# EAGLE schematic unicycle (EAGLE 4.11)
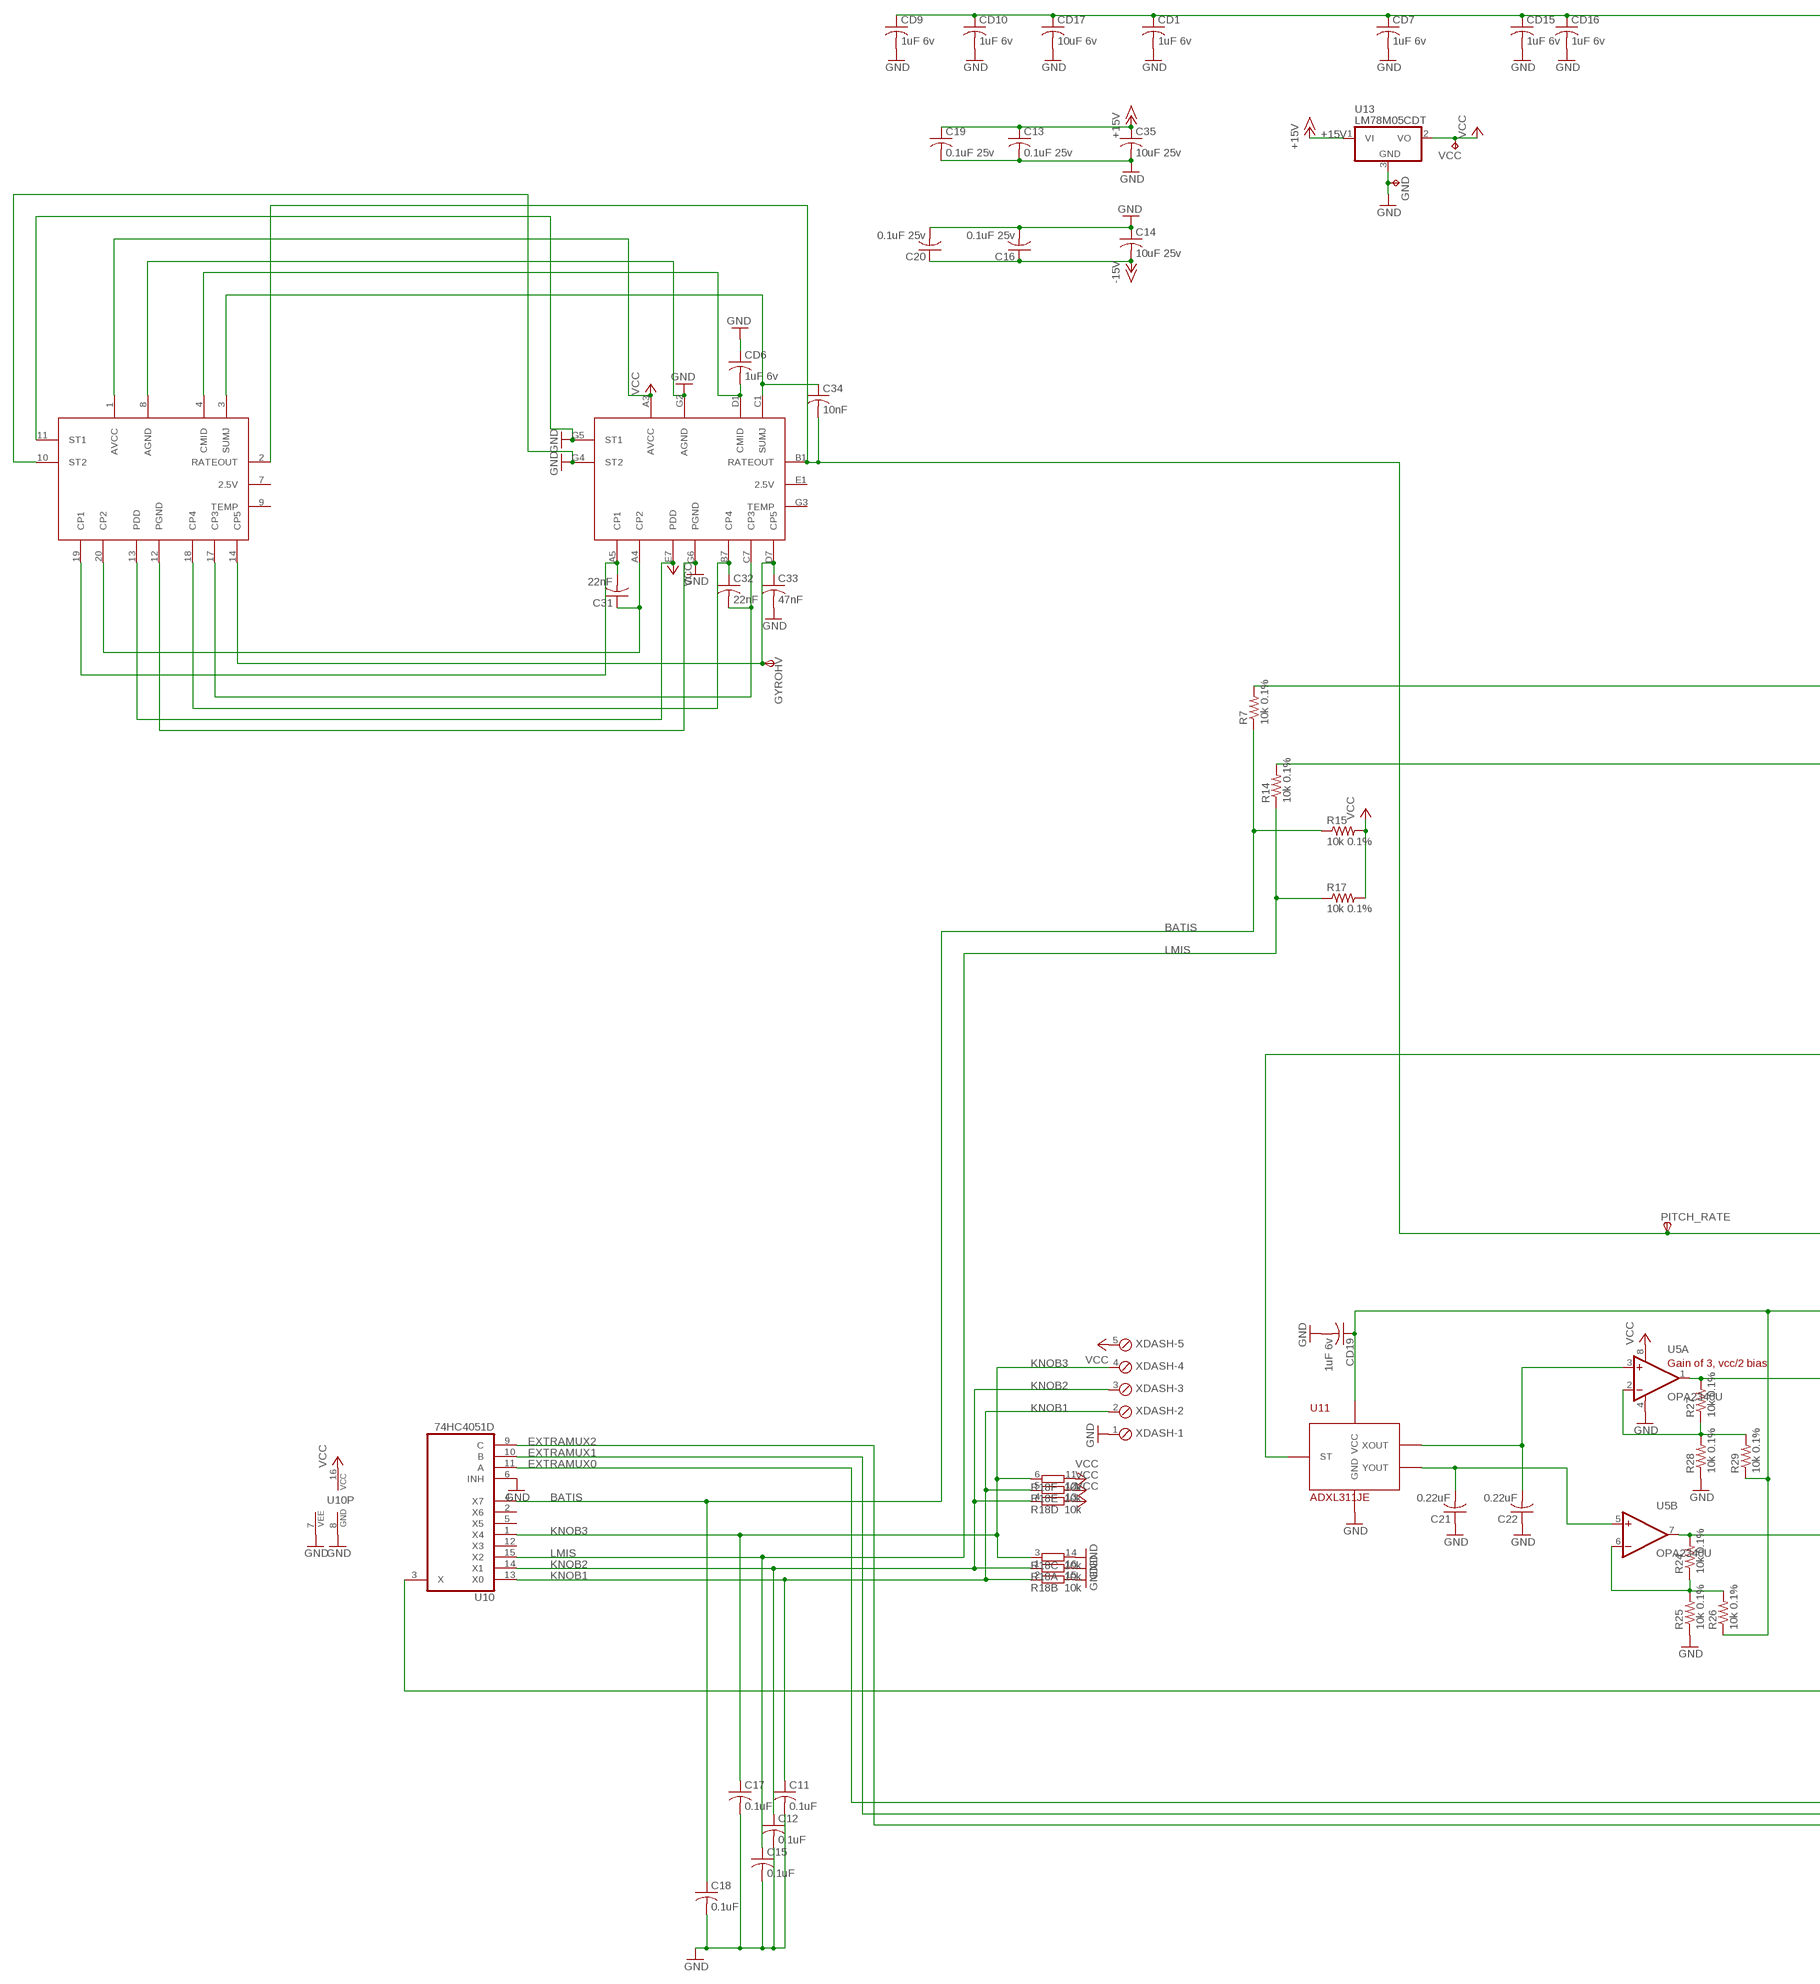
[diagram p0: schematic, sheet 1, part 1 of 3]
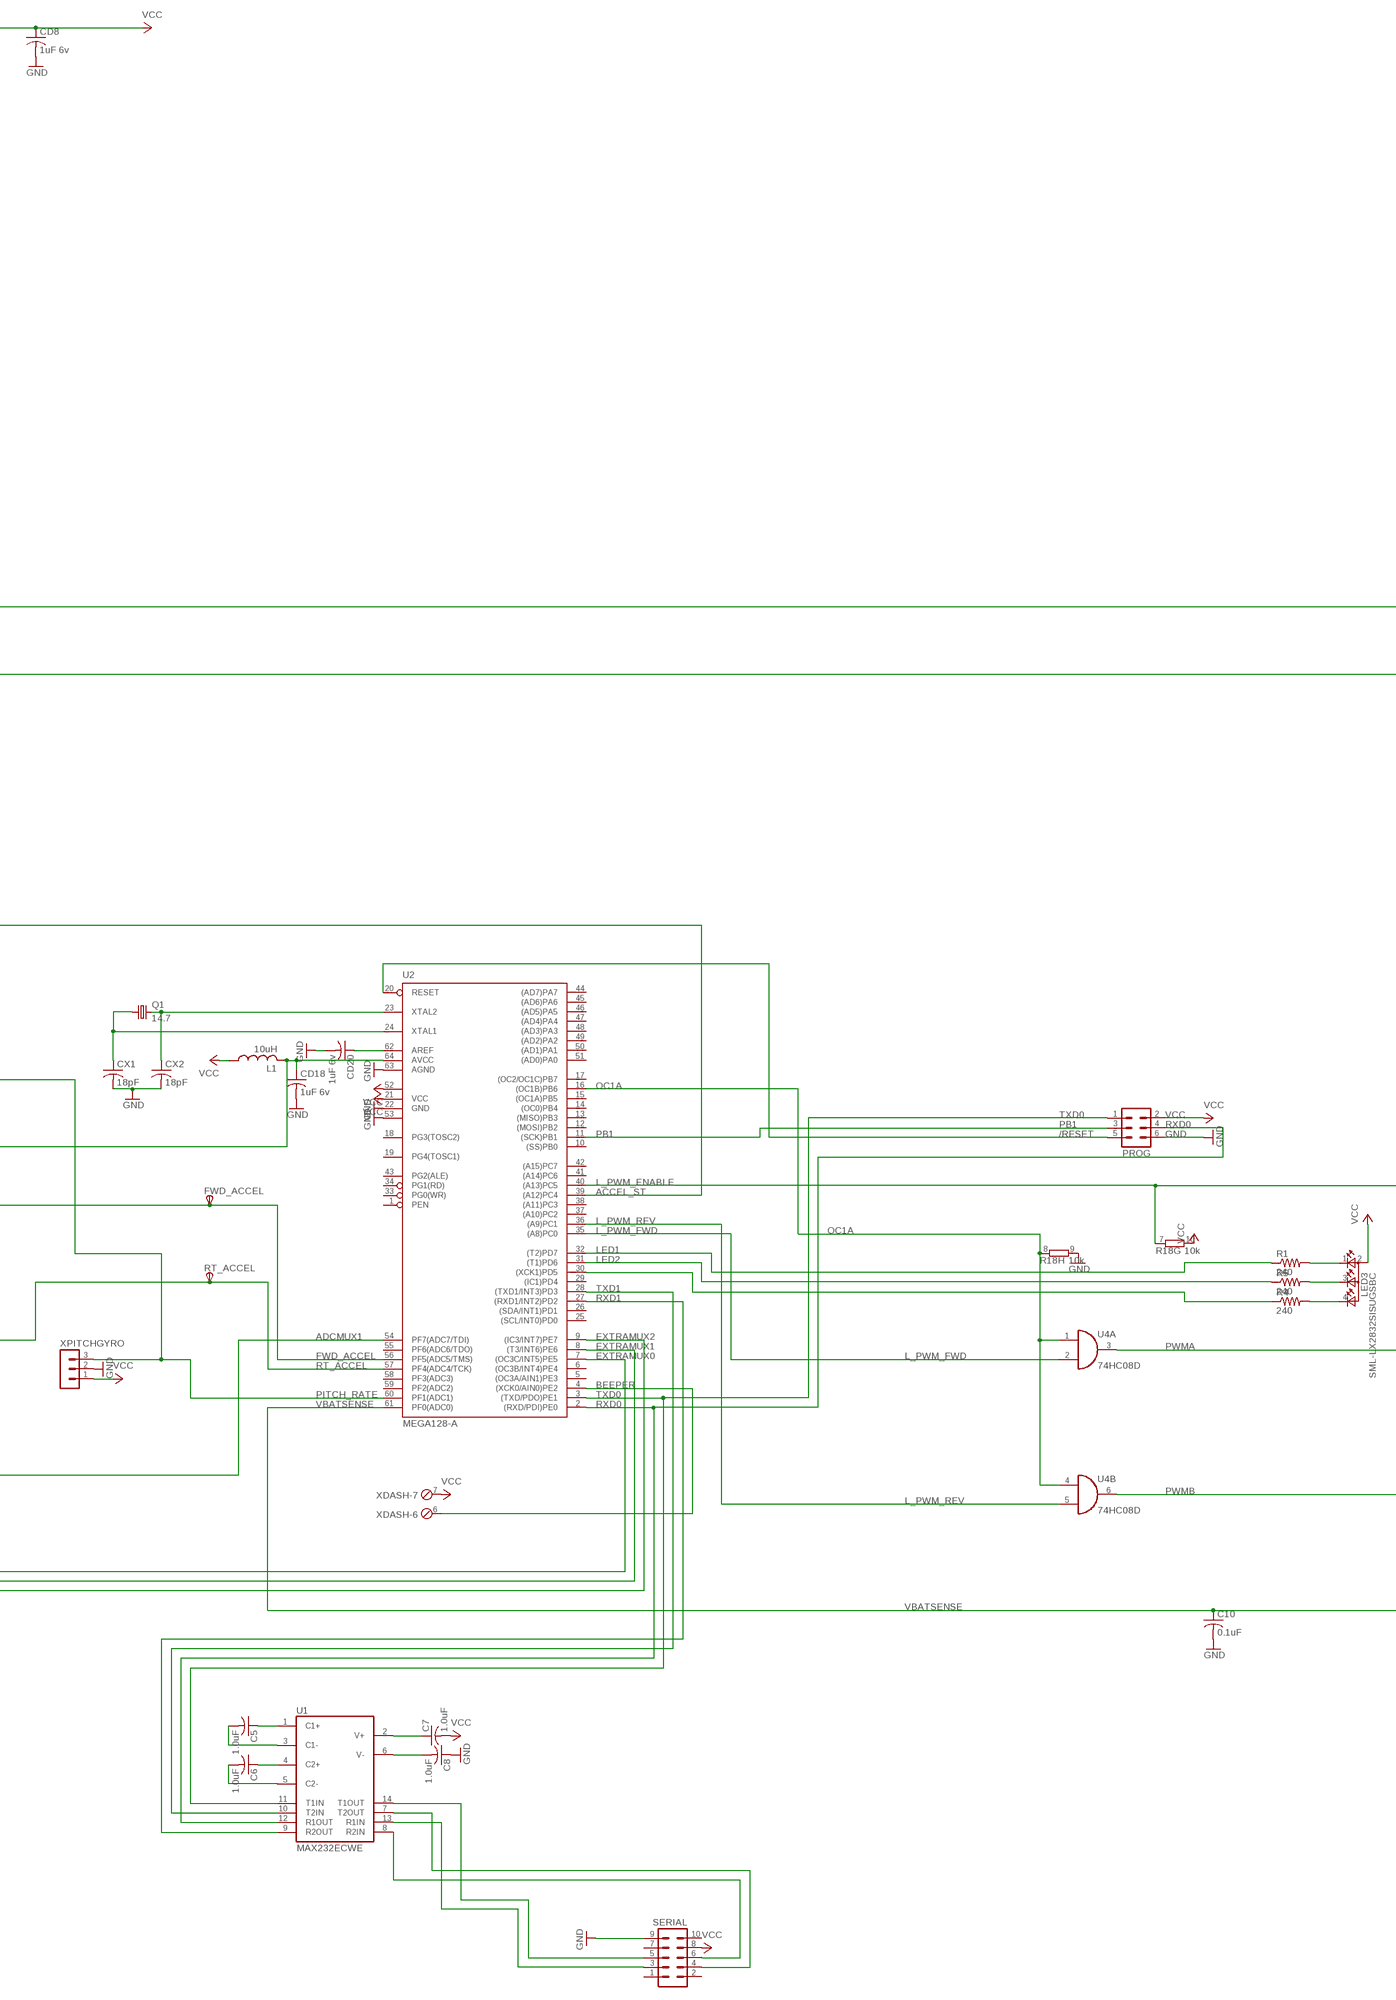
[diagram p1: schematic, sheet 1, part 2 of 3]
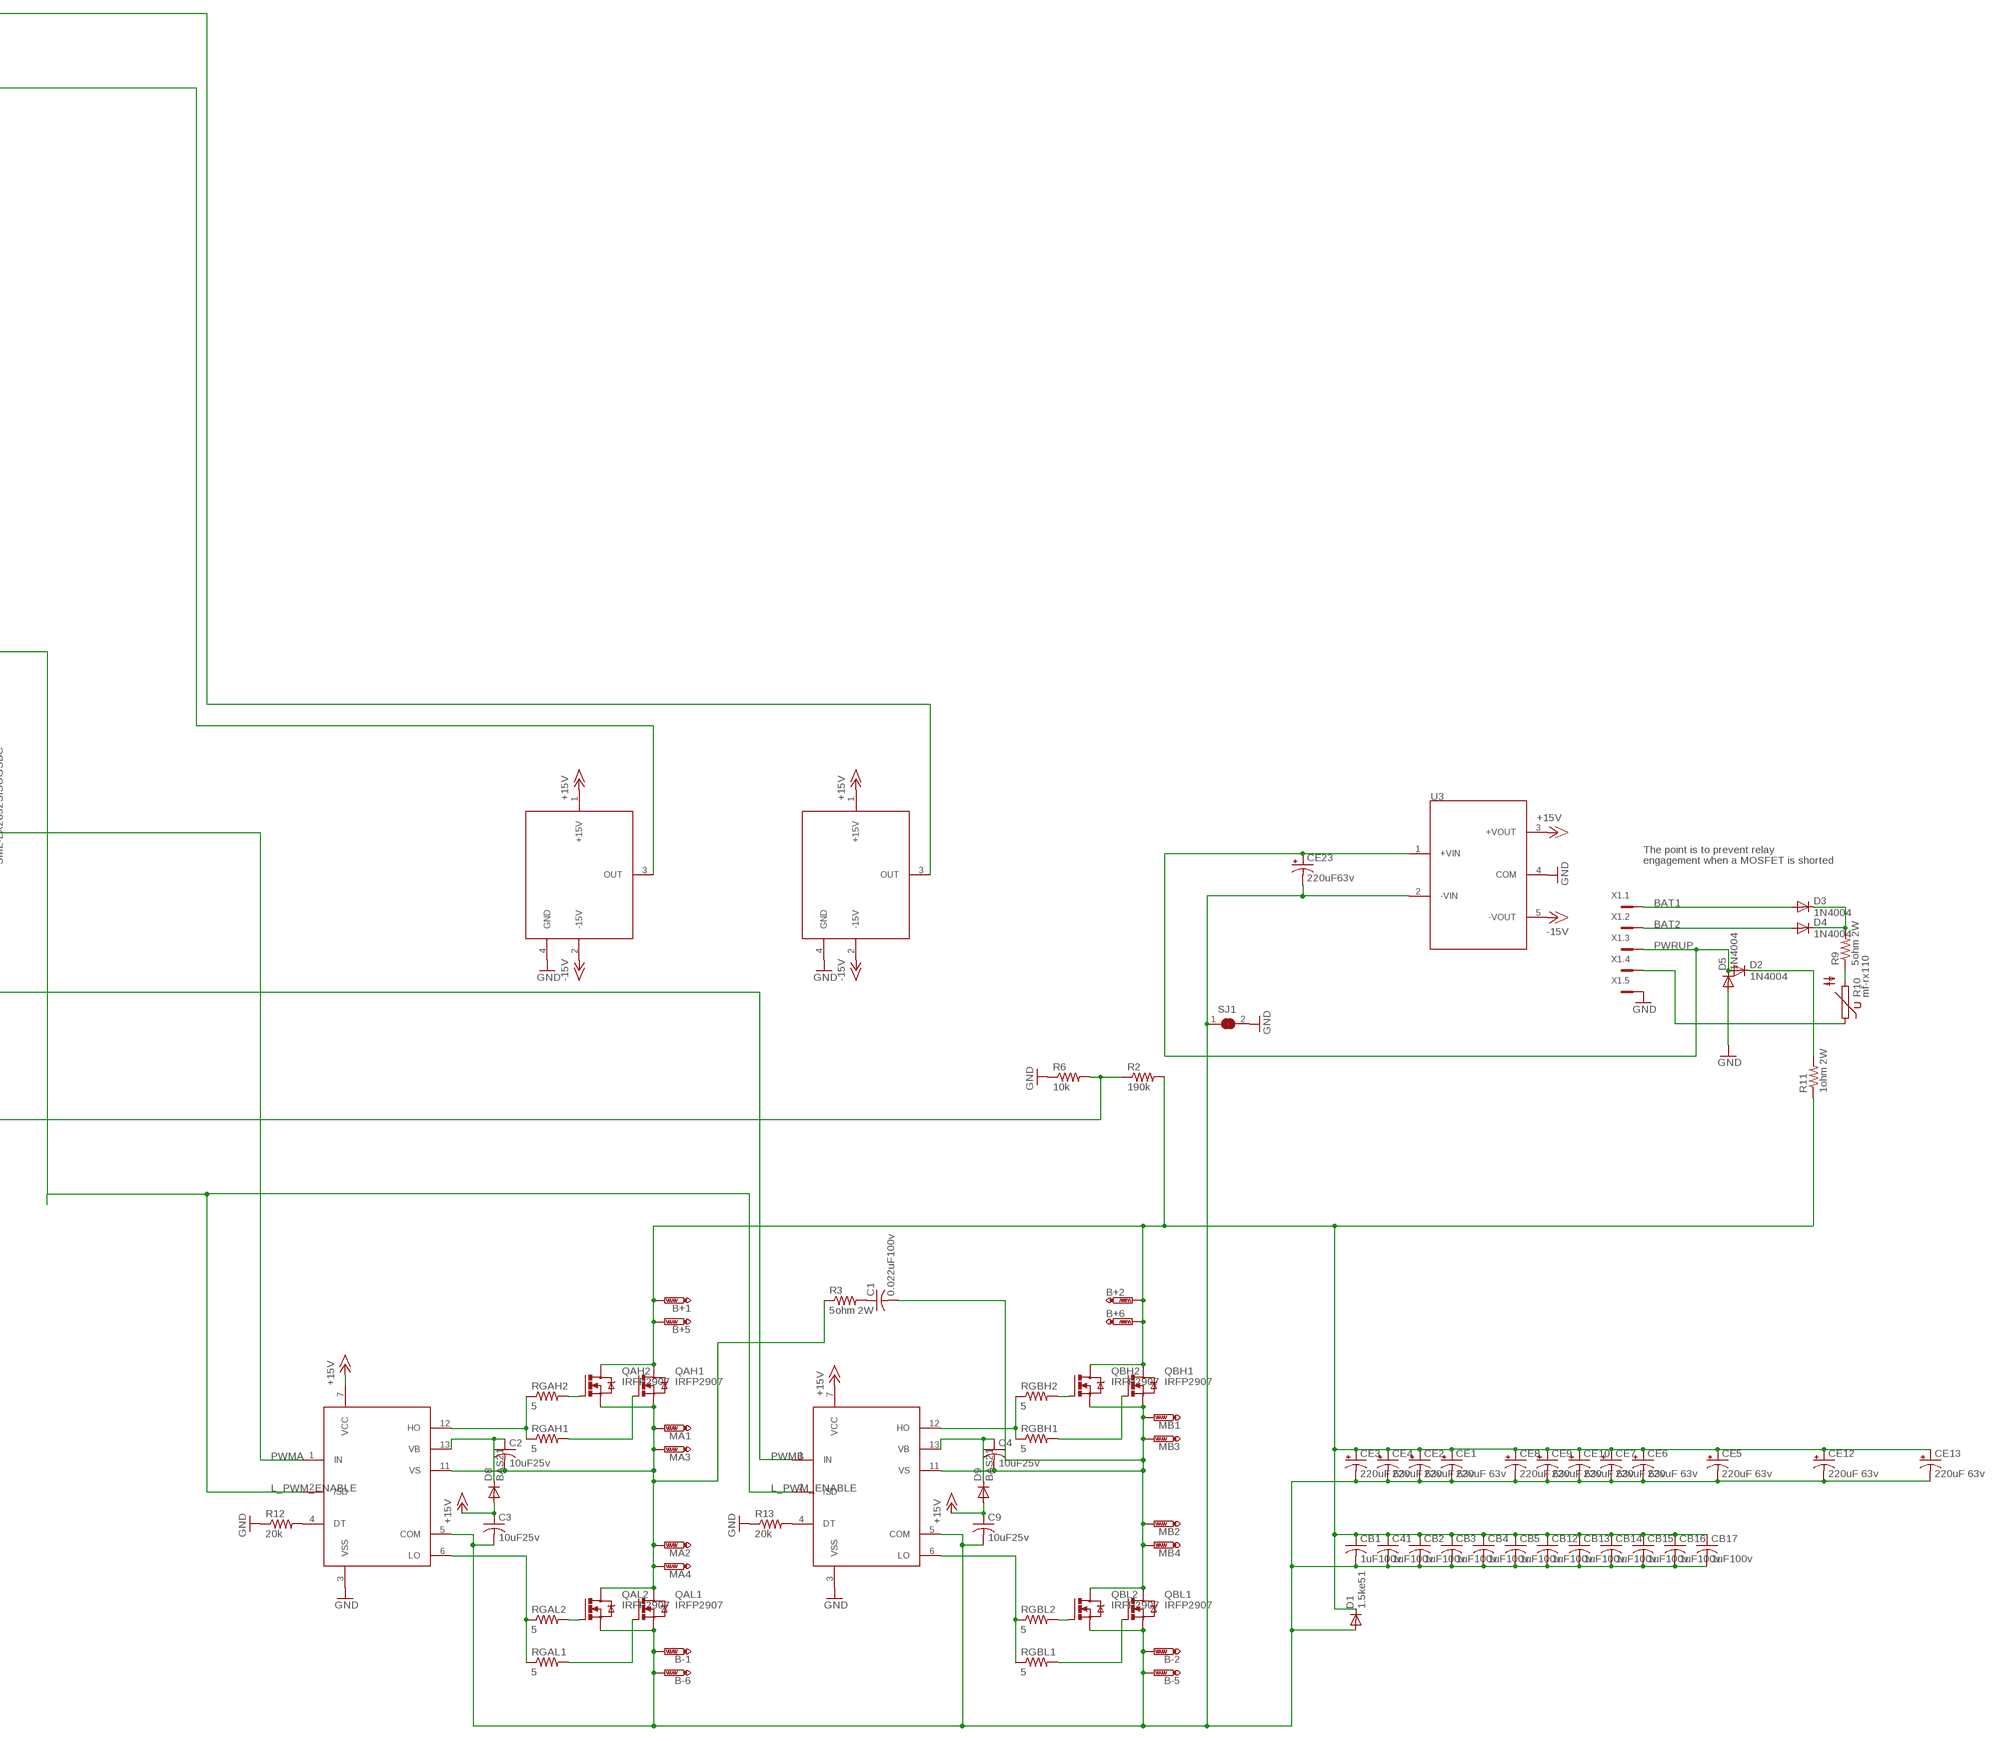
[diagram p2: schematic, sheet 1, part 3 of 3]

## Parts
B+1  PTR1PAD1-17Y  [P1-17Y]
B+2  PTR1PAD1-17Y  [P1-17Y]
B+5  PTR1PAD1-17Y  [P1-17Y]
B+6  PTR1PAD1-17Y  [P1-17Y]
B-1  PTR1PAD1-17Y  [P1-17Y]
B-2  PTR1PAD1-17Y  [P1-17Y]
B-5  PTR1PAD1-17Y  [P1-17Y]
B-6  PTR1PAD1-17Y  [P1-17Y]
BATIS  L08P150D15  [L08P]
C1  0.022uF100v  C-US102-043X133  [C102-043X133]
C2  10uF25v  C-USC1206  [C1206]
C3  10uF25v  C-USC1206  [C1206]
C4  10uF25v  C-USC1206  [C1206]
C5  1.0uF  C-USC0805  [C0805]
C6  1.0uF  C-USC0805  [C0805]
C7  1.0uF  C-USC0805  [C0805]
C8  1.0uF  C-USC0805  [C0805]
C9  10uF25v  C-USC1206  [C1206]
C10  0.1uF  C-USC0805  [C0805]
C11  0.1uF  C-USC0805  [C0805]
C12  0.1uF  C-USC0805  [C0805]
C13  0.1uF 25v  C-USC0805  [C0805]
C14  10uF 25v  C-USC1206  [C1206]
C15  0.1uF  C-USC0805  [C0805]
C16  0.1uF 25v  C-USC0805  [C0805]
C17  0.1uF  C-USC0805  [C0805]
C18  0.1uF  C-USC0805  [C0805]
C19  0.1uF 25v  C-USC0805  [C0805]
C20  0.1uF 25v  C-USC0805  [C0805]
C21  0.22uF  C-USC0805  [C0805]
C22  0.22uF  C-USC0805  [C0805]
C31  22nF  C-USC0402  [C0402]
C32  22nF  C-USC0402  [C0402]
C33  47nF  C-USC0402  [C0402]
C34  10nF  C-USC0402  [C0402]
C35  10uF 25v  C-USC1206  [C1206]
C41  1uF100v  C-USC1812  [C1812]
CB1  1uF100v  C-USC1812  [C1812]
CB2  1uF100v  C-USC1812  [C1812]
CB3  1uF100v  C-USC1812  [C1812]
CB4  1uF100v  C-USC1812  [C1812]
CB5  1uF100v  C-USC1812  [C1812]
CB12  1uF100v  C-USC1812  [C1812]
CB13  1uF100v  C-USC1812  [C1812]
CB14  1uF100v  C-USC1812  [C1812]
CB15  1uF100v  C-USC1812  [C1812]
CB16  1uF100v  C-USC1812  [C1812]
CB17  1uF100v  C-USC1812  [C1812]
CD1  1uF 6v  C-USC0402  [C0402]
CD6  1uF 6v  C-USC0402  [C0402]
CD7  1uF 6v  C-USC0402  [C0402]
CD8  1uF 6v  C-USC0402  [C0402]
CD9  1uF 6v  C-USC0402  [C0402]
CD10  1uF 6v  C-USC0402  [C0402]
CD15  1uF 6v  C-USC0402  [C0402]
CD16  1uF 6v  C-USC0402  [C0402]
CD17  10uF 6v  C-USC0805  [C0805]
CD18  1uF 6v  C-USC0402  [C0402]
CD19  1uF 6v  C-USC0402  [C0402]
CD20  1uF 6v  C-USC0402  [C0402]
CE1  220uF 63v  CPOL-USE5-10.5  [E5-10,5]
CE2  220uF 63v  CPOL-USE5-10.5  [E5-10,5]
CE3  220uF 63v  CPOL-USE5-10.5  [E5-10,5]
CE4  220uF 63v  CPOL-USE5-10.5  [E5-10,5]
CE5  220uF 63v  CPOL-USE5-10.5  [E5-10,5]
CE6  220uF 63v  CPOL-USE5-10.5  [E5-10,5]
CE7  220uF 63v  CPOL-USE5-10.5  [E5-10,5]
CE8  220uF 63v  CPOL-USE5-10.5  [E5-10,5]
CE9  220uF 63v  CPOL-USE5-10.5  [E5-10,5]
CE10  220uF 63v  CPOL-USE5-10.5  [E5-10,5]
CE12  220uF 63v  CPOL-USE5-10.5  [E5-10,5]
CE13  220uF 63v  CPOL-USE5-10.5  [E5-10,5]
CE23  220uF63v  CPOL-USE5-10.5  [E5-10,5]
CX1  18pF  C-USC0402  [C0402]
CX2  18pF  C-USC0402  [C0402]
D1  1.5ke51  DIODE-DO201-15  [DO201-15]
D2  1N4004  DIODE-DO41-10  [DO41-10]
D3  1N4004  DIODE-DO41-10  [DO41-10]
D4  1N4004  DIODE-DO41-10  [DO41-10]
D5  1N4004  DIODE-DO41-10  [DO41-10]
D8  BAS21  [SOT23]
D9  BAS21  [SOT23]
DRV1  IR21844S  [14-SOIC]
DRV2  IR21844S  [14-SOIC]
FWD_ACCEL  TPSPAD1-13  [P1-13]
GND  TPPAD1-13  [P1-13]
GYROHV  TPSPAD1-13  [P1-13]
L1  10uH  L-USL2012C  [L2012C]
LED3  SML-LX2832SISUGSBC  TOPLED-3  [P-LCC-4-3]
MA1  PTR1PAD1-17Y  [P1-17Y]
MA2  PTR1PAD1-17Y  [P1-17Y]
MA3  PTR1PAD1-17Y  [P1-17Y]
MA4  PTR1PAD1-17Y  [P1-17Y]
MB1  PTR1PAD1-17Y  [P1-17Y]
MB2  PTR1PAD1-17Y  [P1-17Y]
MB3  PTR1PAD1-17Y  [P1-17Y]
MB4  PTR1PAD1-17Y  [P1-17Y]
PITCH_RATE  TPSPAD1-13  [P1-13]
PROG  MA03-2  [MA03-2]
Q1  14.7  CRYTALHC49S  [HC49/S]
QAH1  IRFP2907  IRFPC40  [TO247BV]
QAH2  IRFP2907  IRFPC40  [TO247BV]
QAL1  IRFP2907  IRFPC40  [TO247BV]
QAL2  IRFP2907  IRFPC40  [TO247BV]
QBH1  IRFP2907  IRFPC40  [TO247BV]
QBH2  IRFP2907  IRFPC40  [TO247BV]
QBL1  IRFP2907  IRFPC40  [TO247BV]
QBL2  IRFP2907  IRFPC40  [TO247BV]
R1  240  R-US_R0805  [R0805]
R2  190k  R-US_R0805  [R0805]
R3  5ohm 2W  R-US_0414/15  [0414/15]
R4  240  R-US_R0805  [R0805]
R5  240  R-US_R0805  [R0805]
R6  10k  R-US_R0805  [R0805]
R7  10k 0.1%  R-US_R0805  [R0805]
R9  5ohm 2W  R-US_0414/15  [0414/15]
R10  mf-rx110  S05K40  [S05K40]
R11  1ohm 2W  R-US_0414/15  [0414/15]
R12  20k  R-US_R0805  [R0805]
R13  20k  R-US_R0805  [R0805]
R14  10k 0.1%  R-US_R0805  [R0805]
R15  10k 0.1%  R-US_R0805  [R0805]
R17  10k 0.1%  R-US_R0805  [R0805]
R18  10k  4816P-T01E  [4816P]
R24  10k 0.1%  R-US_R0805  [R0805]
R25  10k 0.1%  R-US_R0805  [R0805]
R26  10k 0.1%  R-US_R0805  [R0805]
R27  10k 0.1%  R-US_R0805  [R0805]
R28  10k 0.1%  R-US_R0805  [R0805]
R29  10k 0.1%  R-US_R0805  [R0805]
RGAH1  5  R-US_R0805  [R0805]
RGAH2  5  R-US_R0805  [R0805]
RGAL1  5  R-US_R0805  [R0805]
RGAL2  5  R-US_R0805  [R0805]
RGBH1  5  R-US_R0805  [R0805]
RGBH2  5  R-US_R0805  [R0805]
RGBL1  5  R-US_R0805  [R0805]
RGBL2  5  R-US_R0805  [R0805]
RMIS  L08P150D15  [L08P]
RT_ACCEL  TPSPAD1-13  [P1-13]
SERIAL  MA05-2  [MA05-2]
SJ1  SJ  [SJ]
U1  MAX232ECWE  [SO16L]
U2  MEGA128-A  [TQFP64]
U3  DFC10U48D15  [DFC10]
U4  74HC08D  [SO14]
U5  OPA2340U  [SO08]
U10  74HC4051D  4051D  [SO16]
U11  ADXL311JE  [E-8]
U13  LM78M05CDT  7805DT  [TO252]
U15  ADXRS150ABG  [BC-32]
U16  ADXRS150ABGEB  [DIL20]
VCC  TPPAD1-13  [P1-13]
X1  MC5  [MC5]
XDASH  MPT7  [7POL254]
XPITCHGYRO  MA03-1  [MA03-1]

## Nets
+15V [pwr]: BATIS.1(+15V) C3.1 C9.1 C13.1 C19.1 C35.1 D8.1(A) D9.1(A) DRV1.7(VCC) DRV2.7(VCC) RMIS.1(+15V) U3.3(+VOUT) U13.1(VI)
-15V [pwr]: BATIS.2(-15V) C14.2 C16.1 C20.1 RMIS.2(-15V) U3.5(-VOUT)
/RESET: PROG.5 U2.20(RESET)
ACCEL_ST: U2.39((A12)PC4) U11.1(ST)
ADCMUX1: U2.54(PF7(ADC7/TDI)) U10.3(X)
AREF: CD20.1 U2.62(AREF)
AVCC: CD18.1 CD19.1 L1.2 R26.1 R29.1 U2.64(AVCC) U11.8(VCC)
B+ [pwr]: B+1.1(TP) B+2.1(TP) B+5.1(TP) B+6.1(TP) C41.1 CB1.1 CB2.1 CB3.1 CB4.1 CB5.1 CB12.1 CB13.1 CB14.1 CB15.1 CB16.1 CB17.1 CE1.+ CE2.+ CE3.+ CE4.+ CE5.+ CE6.+ CE7.+ CE8.+ CE9.+ CE10.+ CE12.+ CE13.+ D1.C QAH1.D QAH2.D QBH1.D QBH2.D R2.2 R11.1
B- [pwr]: B-1.1(TP) B-2.1(TP) B-5.1(TP) B-6.1(TP) C3.2 C9.2 C41.2 CB1.2 CB2.2 CB3.2 CB4.2 CB5.2 CB12.2 CB13.2 CB14.2 CB15.2 CB16.2 CB17.2 CE1.- CE2.- CE3.- CE4.- CE5.- CE6.- CE7.- CE8.- CE9.- CE10.- CE12.- CE13.- CE23.- D1.A DRV1.5(COM) DRV2.5(COM) QAL1.S QAL2.S QBL1.S QBL2.S SJ1.1 U3.2(-VIN)
BAT1 [highsig]: D3.A X1.1
BAT2 [highsig]: D4.A X1.2
BATBOTH: R10.1 X1.4
BATIS: C18.1 R7.1 R15.1 U10.4(X7)
BATISIN: BATIS.3(OUT) R7.2
BEEPER: U2.4((XCK0/AIN0)PE2) XDASH.6
EXTRAMUX0: U2.7((OC3C/INT5)PE5) U10.11(A)
EXTRAMUX1: U2.8((T3/INT6)PE6) U10.10(B)
EXTRAMUX2: U2.9((IC3/INT7)PE7) U10.9(C)
FWD_ACCEL: FWD_ACCEL.1(PP) R27.2 U2.56(PF5(ADC5/TMS)) U5.1(A:OUT)
GAH [highsig]: DRV1.12(HO) RGAH1.1 RGAH2.1
GAL [highsig]: DRV1.6(LO) RGAL1.1 RGAL2.1
GBH [highsig]: DRV2.12(HO) RGBH1.1 RGBH2.1
GBL [highsig]: DRV2.6(LO) RGBL1.1 RGBL2.1
GND [pwr]: BATIS.4(GND) C8.1 C10.2 C11.2 C12.2 C13.2 C14.1 C15.2 C16.2 C17.2 C18.2 C19.2 C20.2 C21.1 C22.1 C33.2 C35.2 CD1.2 CD6.1 CD7.2 CD8.2 CD9.2 CD10.2 CD15.2 CD16.2 CD17.2 CD18.2 CD19.2 CD20.2 CX1.2 CX2.2 D5.A DRV1.3(VSS) DRV2.3(VSS) GND.1(TP) PROG.6 R6.1 R12.1 R13.1 R18.9 R18.14 R18.15 R18.16 R25.1 R28.1 RMIS.4(GND) SERIAL.9 SJ1.2 U2.22(GND) U2.53(GND1) U2.63(AGND) U3.4(COM) U5.4(A:V-) U10.6(INH) U10.7(VEE) U10.8(GND) U11.3(GND) U13.3(GND) U15.G2(AGND) U15.G4(ST2) U15.G5(ST1) U15.G6(PGND) U16.8(AGND) U16.10(ST2) U16.11(ST1) U16.12(PGND) X1.5 XDASH.1 XPITCHGYRO.2
KNOB1: C11.1 R18.2 R18.5 U10.13(X0) XDASH.2
KNOB2: C12.1 R18.1 R18.4 U10.14(X1) XDASH.3
KNOB3: C17.1 R18.3 R18.6 U10.1(X4) XDASH.4
L_PWM_ENABLE: DRV1.2(/SD) DRV2.2(/SD) R18.7 U2.40((A13)PC5)
L_PWM_FWD: U2.35((A8)PC0) U4.2(A:I1)
L_PWM_REV: U2.36((A9)PC1) U4.5(B:I1)
LED1: R1.1 U2.32((T2)PD7)
LED2: R5.1 U2.31((T1)PD6)
LMIS: C15.1 R14.1 R17.1 U10.15(X2)
LMISIN: R14.2 RMIS.3(OUT)
MA [highsig]: C2.2 DRV1.11(VS) MA1.1(TP) MA2.1(TP) MA3.1(TP) MA4.1(TP) QAH1.S QAH2.S QAL1.D QAL2.D R3.1
MB [highsig]: C1.2 C4.2 DRV2.11(VS) MB1.1(TP) MB2.1(TP) MB3.1(TP) MB4.1(TP) QBH1.S QBH2.S QBL1.D QBL2.D
MCUXTAL1: CX1.1 Q1.1 U2.24(XTAL1)
MCUXTAL2: CX2.1 Q1.2 U2.23(XTAL2)
N$1 [pwr]: D2.C R11.2
N$2 [pwr]: C1.1 R3.2
N$3: DRV1.4(DT) R12.2
N$4 [pwr]: LED3.3(CBLUE) R5.2
N$5 [pwr]: LED3.1(CRED) R1.2
N$6: R4.1 U2.30((XCK1)PD5)
N$7 [highsig]: R9.1 R10.2
N$8 [highsig]: D3.C D4.C R9.2
N$9: DRV2.4(DT) R13.2
N$10: LED3.4(CGREEN) R4.2
N$11: C5.1 U1.1(C1+)
N$12: C6.1 U1.4(C2+)
N$20: C6.2 U1.5(C2-)
N$22: C5.2 U1.3(C1-)
N$24: C7.1 U1.2(V+)
N$25: C22.2 U5.3(A:+IN) U11.7(XOUT)
N$26: C8.2 U1.6(V-)
N$27: C21.2 U5.5(B:+IN) U11.6(YOUT)
N$28: R24.1 R25.2 R26.2 U5.6(B:-IN)
N$29: R27.1 R28.2 R29.2 U5.2(A:-IN)
N$30: CD6.2 U15.D1(CMID) U16.4(CMID)
N$31: C32.1 U15.B7(CP4) U16.18(CP4)
N$32: C32.2 U15.C7(CP3) U16.17(CP3)
N$33: SERIAL.5 U1.14(T1OUT)
N$34: SERIAL.3 U1.13(R1IN)
N$35: SERIAL.4 U1.7(T2OUT)
N$36: SERIAL.6 U1.8(R2IN)
N$37: C31.2 U15.A5(CP1) U16.19(CP1)
N$38: C31.1 U15.A4(CP2) U16.20(CP2)
N$39: C33.1 GYROHV.1(PP) U15.D7(CP5) U16.14(CP5)
N$40: C34.1 U15.C1(SUMJ) U16.3(SUMJ)
OC1A: R18.8 U2.16((OC1B)PB6) U4.1(A:I0) U4.4(B:I0)
PB1: PROG.3 U2.11((SCK)PB1)
PITCH_RATE: C34.2 PITCH_RATE.1(PP) U2.60(PF1(ADC1)) U15.B1(RATEOUT) U16.2(RATEOUT) XPITCHGYRO.3
PWMA: DRV1.1(IN) U4.3(A:O)
PWMB: DRV2.1(IN) U4.6(B:O)
PWRUP: CE23.+ D2.A D5.C U3.1(+VIN) X1.3
Q1G [highsig]: QAH1.G RGAH1.2
Q2G [highsig]: QAH2.G RGAH2.2
Q3G [highsig]: QAL1.G RGAL1.2
Q4G [highsig]: QAL2.G RGAL2.2
Q5G [highsig]: QBH1.G RGBH1.2
Q6G [highsig]: QBH2.G RGBH2.2
Q7G [highsig]: QBL1.G RGBL1.2
Q8G [highsig]: QBL2.G RGBL2.2
RT_ACCEL: R24.2 RT_ACCEL.1(PP) U2.57(PF4(ADC4/TCK)) U5.7(B:OUT)
RXD0: PROG.4 U1.12(R1OUT) U2.2((RXD/PDI)PE0)
RXD1: U1.9(R2OUT) U2.27((RXD1/INT2)PD2)
TXD0: PROG.1 U1.11(T1IN) U2.3((TXD/PDO)PE1)
TXD1: U1.10(T2IN) U2.28((TXD1/INT3)PD3)
VB1 [highpwr]: C2.1 D8.3(C) DRV1.13(VB)
VB2 [highpwr]: C4.1 D9.3(C) DRV2.13(VB)
VBATSENSE: C10.1 R2.1 R6.2 U2.61(PF0(ADC0))
VCC [pwr]: C7.2 CD1.1 CD7.1 CD8.1 CD9.1 CD10.1 CD15.1 CD16.1 CD17.1 L1.1 LED3.2(A2) PROG.2 R15.2 R17.2 R18.10 R18.11 R18.12 R18.13 SERIAL.8 U2.21(VCC) U2.52(VCC1) U5.8(A:V+) U10.16(VCC) U13.2(VO) U15.A3(AVCC) U15.E7(PDD) U16.1(AVCC) U16.13(PDD) VCC.1(TP) XDASH.5 XDASH.7 XPITCHGYRO.1
Unconnected: SERIAL.1 SERIAL.2 SERIAL.7 SERIAL.10 U2.1(PEN) U2.5((OC3A/AIN1)PE3) U2.6((OC3B/INT4)PE4) U2.10((SS)PB0) U2.12((MOSI)PB2) U2.13((MISO)PB3) U2.14((OC0)PB4) U2.15((OC1A)PB5) U2.17((OC2/OC1C)PB7) U2.18(PG3(TOSC2)) U2.19(PG4(TOSC1)) U2.25((SCL/INT0)PD0) U2.26((SDA/INT1)PD1) U2.29((IC1)PD4) U2.33(PG0(WR)) U2.34(PG1(RD)) U2.37((A10)PC2) U2.38((A11)PC3) U2.41((A14)PC6) U2.42((A15)PC7) U2.43(PG2(ALE)) U2.44((AD7)PA7) U2.45((AD6)PA6) U2.46((AD5)PA5) U2.47((AD4)PA4) U2.48((AD3)PA3) U2.49((AD2)PA2) U2.50((AD1)PA1) U2.51((AD0)PA0) U2.55(PF6(ADC6/TDO)) U2.58(PF3(ADC3)) U2.59(PF2(ADC2)) U4.8(C:O) U4.9(C:I0) U4.10(C:I1) U4.11(D:O) U4.12(D:I0) U4.13(D:I1) U10.2(X6) U10.5(X5) U10.12(X3) U15.E1(2.5V) U15.G3(TEMP) U16.7(2.5V) U16.9(TEMP)

## Notes on the sheet
- Gain of 3, vcc/2 bias
- The point is to prevent relay
- engagement when a MOSFET is shorted

## Power pins joined to a net without a drawn wire
GND: U1.15(GND) U4.7(P:GND)
VCC: U1.16(VCC) U4.14(P:VCC)

## Library data of the parts
B+1 B+2 B+5 B+6 B-1 B-2 B-5 B-6 MA1-MA4 MB1-MB4 = testpad:PTR1: TEST PIN
BATIS RMIS = tlb:L08P150D15
C1-C22 C31-C35 C41 CB1-CB5 CB12-CB17 CD1 CD6-CD10 CD15-CD20 CX1 CX2 = rcl:C-US: CAPACITOR, American symbol
CE1-CE10 CE12 CE13 CE23 = rcl:CPOL-US: POLARIZED CAPACITOR, American symbol
D1-D5 = diode:DIODE-: DIODE
D8 D9 = tlb:BAS21: DIODE high speed (Philips)
DRV1 DRV2 = tlb:IR21844S
FWD_ACCEL GYROHV PITCH_RATE RT_ACCEL = testpad:TPS: TEST PIN
GND VCC = testpad:TP
L1 = rcl:L-US: INDUCTOR, American symbol
LED3 = led:TOPLED-3: OSRAM - Hyper Multi TOPLED® (RGB) LB E673, LV E673, LT E673 - Power TOPLED® Enhanced optical Power LED (HOP2000) LS E67B, LA E67B, LO E67B, LY E67B - Hyper Multi TOPLED® Enhanced optical Power LED (HOP2000 / ATON®) LATB T66B - Hyper Multi TOPLED® Hyper-Bright LED LATB T686 Source: http://www.osram.convergy.de/
PROG = con-lstb:MA03-2: PIN HEADER
Q1 = crystal:CRYTAL: CRYSTAL
QAH1 QAH2 QAL1 QAL2 QBH1 QBH2 QBL1 QBL2 = transistor-power:IRFPC40: N-CHANNEL MOS FET
R1-R7 R9 R11-R15 R17 R24-R29 RGAH1 RGAH2 RGAL1 RGAL2 RGBH1 RGBH2 RGBL1 RGBL2 = rcl:R-US_: RESISTOR, American symbol
R10 = varistor:S05K40: VARISTOR
R18 = resistor-bourns:4816P-T01E: BOURNS RESISTOR NETWORK
SERIAL = con-lstb:MA05-2: PIN HEADER
SJ1 = jumper:SJ: SMD solder JUMPER
U1 = maxim:MAX232ECWE: RS232 TRANSEIVER
U2 = avr:MEGA128: MICROCONTROLLER 128 Kbytes FLASH 4 Kbytes SRAM 4 Kbytes EEPROM DUAL USART 8-channel 10 bit ADC
U3 = tlb:DFC10U48D15
U4 = 74xx-eu:74*08: Quad 2-input AND gate
U5 = burr-brown:OPA2340: Single-Supply, Rail-to-Rail Operational Amplifiers MicroAmplifier(TM) Series; Product Folder:OPA2340
U10 = 40xx:4051: 8-channel ANALOG MULTIPLEXER
U11 = tlb:ADXL311JE
U13 = linear:78*: Positive VOLTAGE REGULATOR
U15 U16 = tlb:ADXRS150ABG
X1 = con-phoenix-381_l:MC5: Mini-Combicon 3.81mm horizontal 5-polig (ohne Gegenstecker)
XDASH = con-phoenix-254:MPT7: PHOENIX CONNECTOR
XPITCHGYRO = con-lstb:MA03-1: PIN HEADER

## Net classes
1 pwr: width 0.254 mm
2 highsig: width 0.406 mm, clearance 0.61 mm
3 highpwr: width 0.61 mm, clearance 0.61 mm